# Altium schematic sheet Clock-Gen.SchDoc: =ProjectTitle
size A3; Author: Jaime I. Chait; Organization: NWES LLC; Address1: 111 SW 5th Ave, STE 3150; Address2: Portland, OR 97204; SheetNumber: 18; SheetTotal: 19
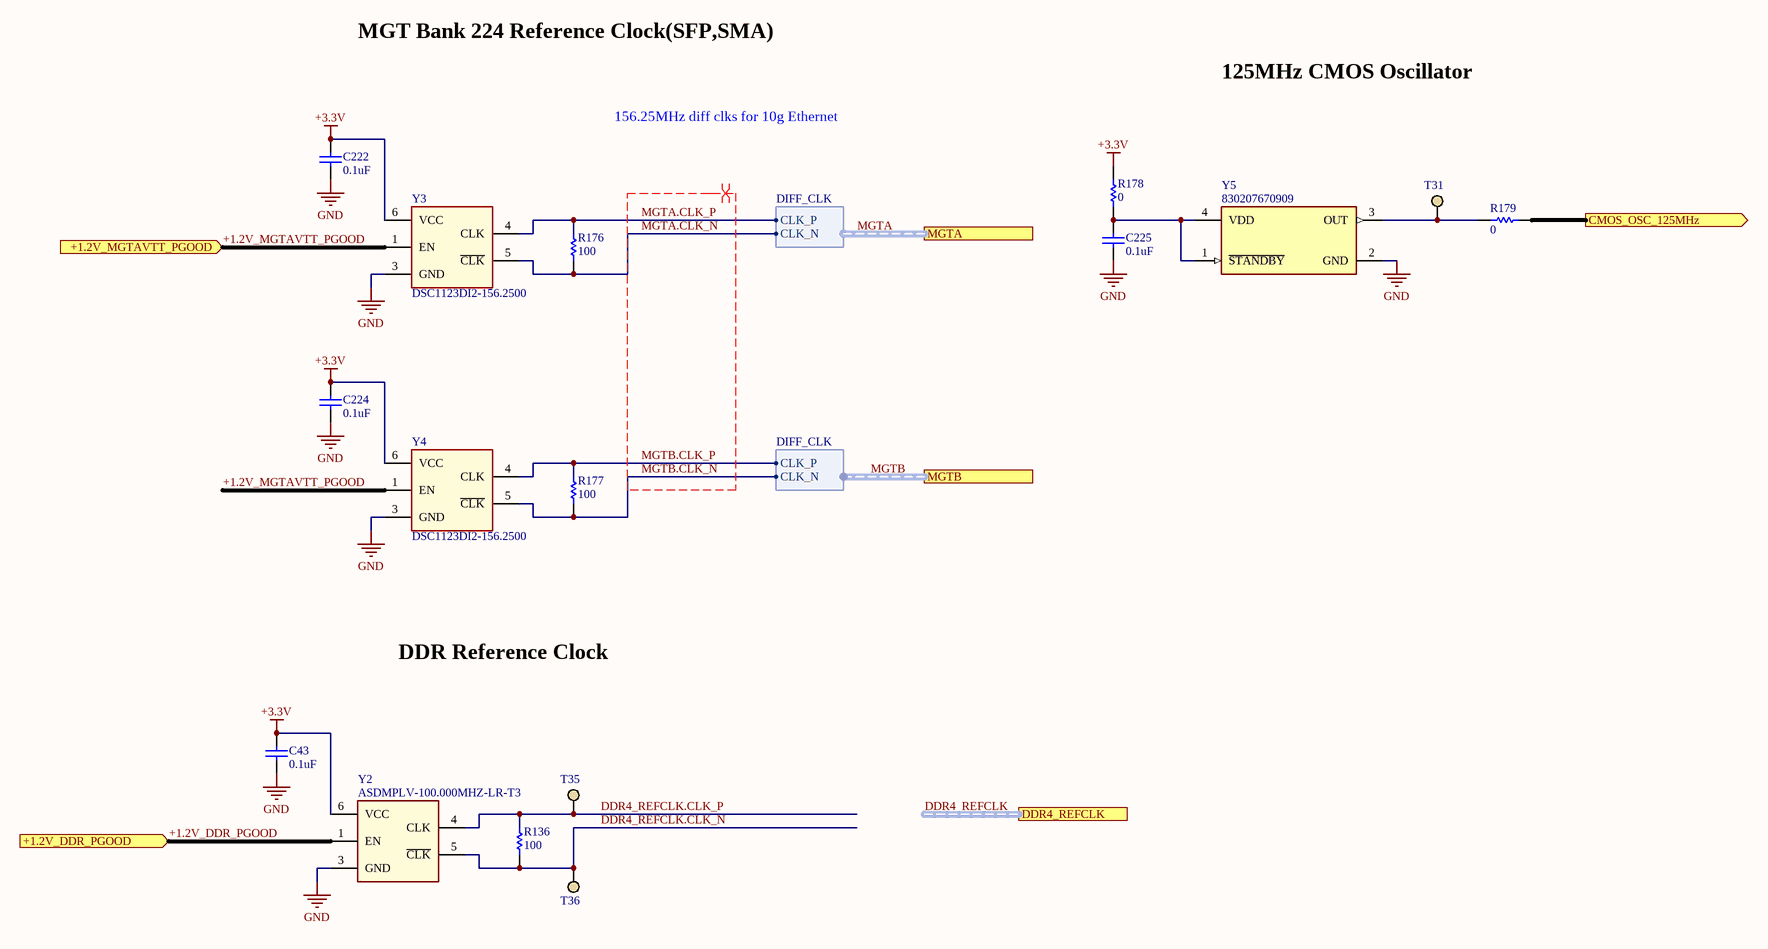
[diagram p0: Clock-Gen.SchDoc]

## Parts
C43  0.1uF  [CAPC1005X55USR]
C222  0.1uF  [CAPC1005X55USR]
C224  0.1uF  [CAPC1005X55USR]
C225  0.1uF  [CAPC1005X55USR]
R136  100  [RESC1005X40USR]
R176  100  [RESC1005X40USR]
R177  100  [RESC1005X40USR]
R178  0  [RESC1005X40USR]
R179  0  [RESC1005X40USR]
T31  TP_S  [TP_SM_1MM]  (value not drawn)  (no BOM)
T35  TP_S  [TP_SM_1MM]  (value not drawn)  (no BOM)
T36  TP_S  [TP_SM_1MM]  (value not drawn)  (no BOM)
Y2  ASDMPLV-100.000MHZ-LR-T3  [6-SMD (2.50mm x 2.00mm)]
Y3  DSC1123DI2-156.2500  [6-SMD (2.50mm x 2.00mm)]
Y4  DSC1123DI2-156.2500  [6-SMD (2.50mm x 2.00mm)]
Y5  830207670909  [XTAL_CX3225SA]

## Ports
+1.2V_DDR_PGOOD (in), +1.2V_MGTAVTT_PGOOD (in), CMOS_OSC_125MHz (out), DDR4_REFCLK (harness DIFF_CLK), MGTA (harness DIFF_CLK), MGTB (harness DIFF_CLK)

## Harnesses
DIFF_CLK: CLK_P, CLK_N

## Nets
+3.3V: C43.1 C222.1 C224.1 R178.1 Y2.6(VCC) Y3.6(VCC) Y4.6(VCC)
GND: C43.2 C222.2 C224.2 C225.2 Y2.3(GND) Y3.3(GND) Y4.3(GND) Y5.2(GND)
+1.2V_DDR_PGOOD: Y2.1(EN) ; port +1.2V_DDR_PGOOD
+1.2V_MGTAVTT_PGOOD: Y3.1(EN) Y4.1(EN) ; port +1.2V_MGTAVTT_PGOOD
CMOS_OSC_125MHz: R179.2 ; port CMOS_OSC_125MHz
DDR4_REFCLK.CLK_N: R136.1 T36.1 Y2.5(~{CLK})
DDR4_REFCLK.CLK_P: R136.2 T35.1 Y2.4(CLK)
MGTA.CLK_N: R176.1 Y3.5(~{CLK}) ; port MGTA.CLK_N
MGTA.CLK_P: R176.2 Y3.4(CLK) ; port MGTA.CLK_P
MGTB.CLK_N: R177.1 Y4.5(~{CLK}) ; port MGTB.CLK_N
MGTB.CLK_P: R177.2 Y4.4(CLK) ; port MGTB.CLK_P
NetC225_1: C225.1 R178.2 Y5.1(~{STANDBY}) Y5.4(VDD)
NetR179_1: R179.1 T31.1 Y5.3(OUT)

## Buses and harness runs
harness DDR4_REFCLK = port DDR4_REFCLK
harness MGTA = port MGTA
harness MGTB = port MGTB

## Layout directives
differential pair: MGTA.CLK_N, MGTA.CLK_P, MGTB.CLK_N, MGTB.CLK_P

## Notes on the sheet
- MGT Bank 224 Reference Clock(SFP,SMA)
- 125MHz CMOS Oscillator
- 156.25MHz diff clks for 10g Ethernet
- DDR Reference Clock
- Title
- Size:
- Date:
- A4
- Number:
- Time:
- Revision:
- Sheet
- of
- File:

## Library data of the parts
C43 C222 C224 C225 = CAP CER 0.1UF 25V X5R 0402: Manufacturer Part Number: CL05A104KA5NNNC; Manufacturer: Samsung Electro-Mechanics; Supplier Part Number 1: 1276-1043-1-ND; Package: 0402; Height: 0.55mm; Supplier 1: Digi-Key; value: 0.1uF
R136 R176 R177 = RES 100 OHM 1% 1/16W 0402: Manufacturer: YAGEO; Manufacturer Part Number: RC0402FR-07100RL; Supplier Part Number 1: 311-100LRCT-ND; Supplier 1: Digi-Key; Height: 0.4mm; Package: 0402; value: 100
R178 R179 = RES 0 OHM JUMPER 1/16W 0402: Manufacturer: Yageo; Manufacturer Part Number: RC0402JR-070RL; Supplier Part Number 1: 311-0.0JRTR-ND; Package: 0402; Height: 0.4mm; Supplier 1: Digi-Key; value: 0
T31 T35 T36 = Test point PAD: test point
Y2 = ASDMPLV-100.000MHZ-LR-T3: Oscillator MEMS 100MHz ±25ppm (Stability) LVDS 52% 2.5V/3.3V 6-Pin QFN SMD T/R; Manufacturer: Abracon; Load Capacitance: 2pF; Max Supply Voltage: 3.6V; Min Supply Voltage: 2.25V; Max Supply Current: 32mA; Supplier 1: Newark; Manufacturer Part Number: ASDMPLV-100.000MHZ-LR-T3; RoHS: Yes; Category: Oscillators; Pricing 1: 1=5.72000, 25=5.68000, 50=5.45000, 100=4.95000, 250=4.83000, 500=4.71000, 1000=4.19000, 3000=4.19000 (USD); Mount: Surface Mount; Case/Package: SMD/SMT; Number of Pins: 6; Min Operating Temperature: -40°C; Max Operating Temperature: 85°C; Packaging: Tape and Reel; Frequency: 100MHz; Frequency Stability: 25ppm; Termination: Solder; Output Format: LVDS; Series: Pure Silicon™ ASDMP; Length: 0.098inch; Width: 0.079inch; Height: 0.033inch; ComponentLink1URL: https://datasheet.ciiva.com/6724/asdmp-6724229.pdf?src-supplier=Digi-Key; ComponentLink1Description: https://datasheet.ciiva.com/6724/asdmp-6724229.pdf?src-supplier=Digi-Key; ComponentLink2URL: https://datasheet.ciiva.com/6724/asdmp-6724565.pdf?src-supplier=Digi-Key; ComponentLink2Description: https://datasheet.ciiva.com/6724/asdmp-6724565.pdf?src-supplier=Digi-Key; Supplier Part Number 1: 56AC7564
Y3 Y4 = DSC1123DI2-156.2500: MEMS Oscillator High Perf Single LVDS Output -40C-85C 25ppm; Manufacturer: Microchip; Frequency: 156.25MHz; Max Supply Current: 32mA; Supplier 1: Digi-Key; Manufacturer Part Number: DSC1123DI2-156.2500; RoHS: Yes; Category: Timers and Oscillators; Stock 1: 484; Pricing 1: 1=3.06000, 25=2.55000, 100=2.50500 (USD); Mount: Surface Mount; Case/Package: SMD/SMT; Min Operating Temperature: -40°C; Max Operating Temperature: 85°C; Frequency Stability: 25ppm; Packaging: Rail/Tube; Length: 0.098inch; Width: 0.079inch; Height: 0.035inch; Ratings: AEC-Q100; ComponentLink1URL: http://www.mouser.com/ds/2/268/DSC1103-23-776891.pdf?src-supplier=Mouser; ComponentLink1Description: http://www.mouser.com/ds/2/268/DSC1103-23-776891.pdf?src-supplier=Mouser; ComponentLink2URL: http://components.arrow.com/part/dataview/66696476S862967N1374?src-supplier=Arrow+Electronics; ComponentLink2Description: http://components.arrow.com/part/dataview/66696476S862967N1374?src-supplier=Arrow+Electronics; ComponentLink3URL: http://www.microchip.com/mymicrochip/filehandler.aspx?ddocname=en576728&src-supplier=Digi-Key; ComponentLink3Description: http://www.microchip.com/mymicrochip/filehandler.aspx?ddocname=en576728&src-supplier=Digi-Key; Supplier Part Number 1: DSC1123DI2-156.2500-ND
Y5 = 830207670909: Xtal Osc Xo 125.0000MHZ Cmos; Manufacturer: Wurth Electronics; Supplier 1: Digi-Key; Manufacturer Part Number: 830207670909; RoHS: No; Category: Oscillators; Stock 1: 3000; Pricing 1: 1=3.06000, 10=2.87500, 50=2.75000, 100=2.62500, 500=2.43750, 1000=2.25000 (USD); Supplier Part Number 1: 1923-830207670909CT-ND